# EAGLE design snesbreakout (EAGLE 4.15)
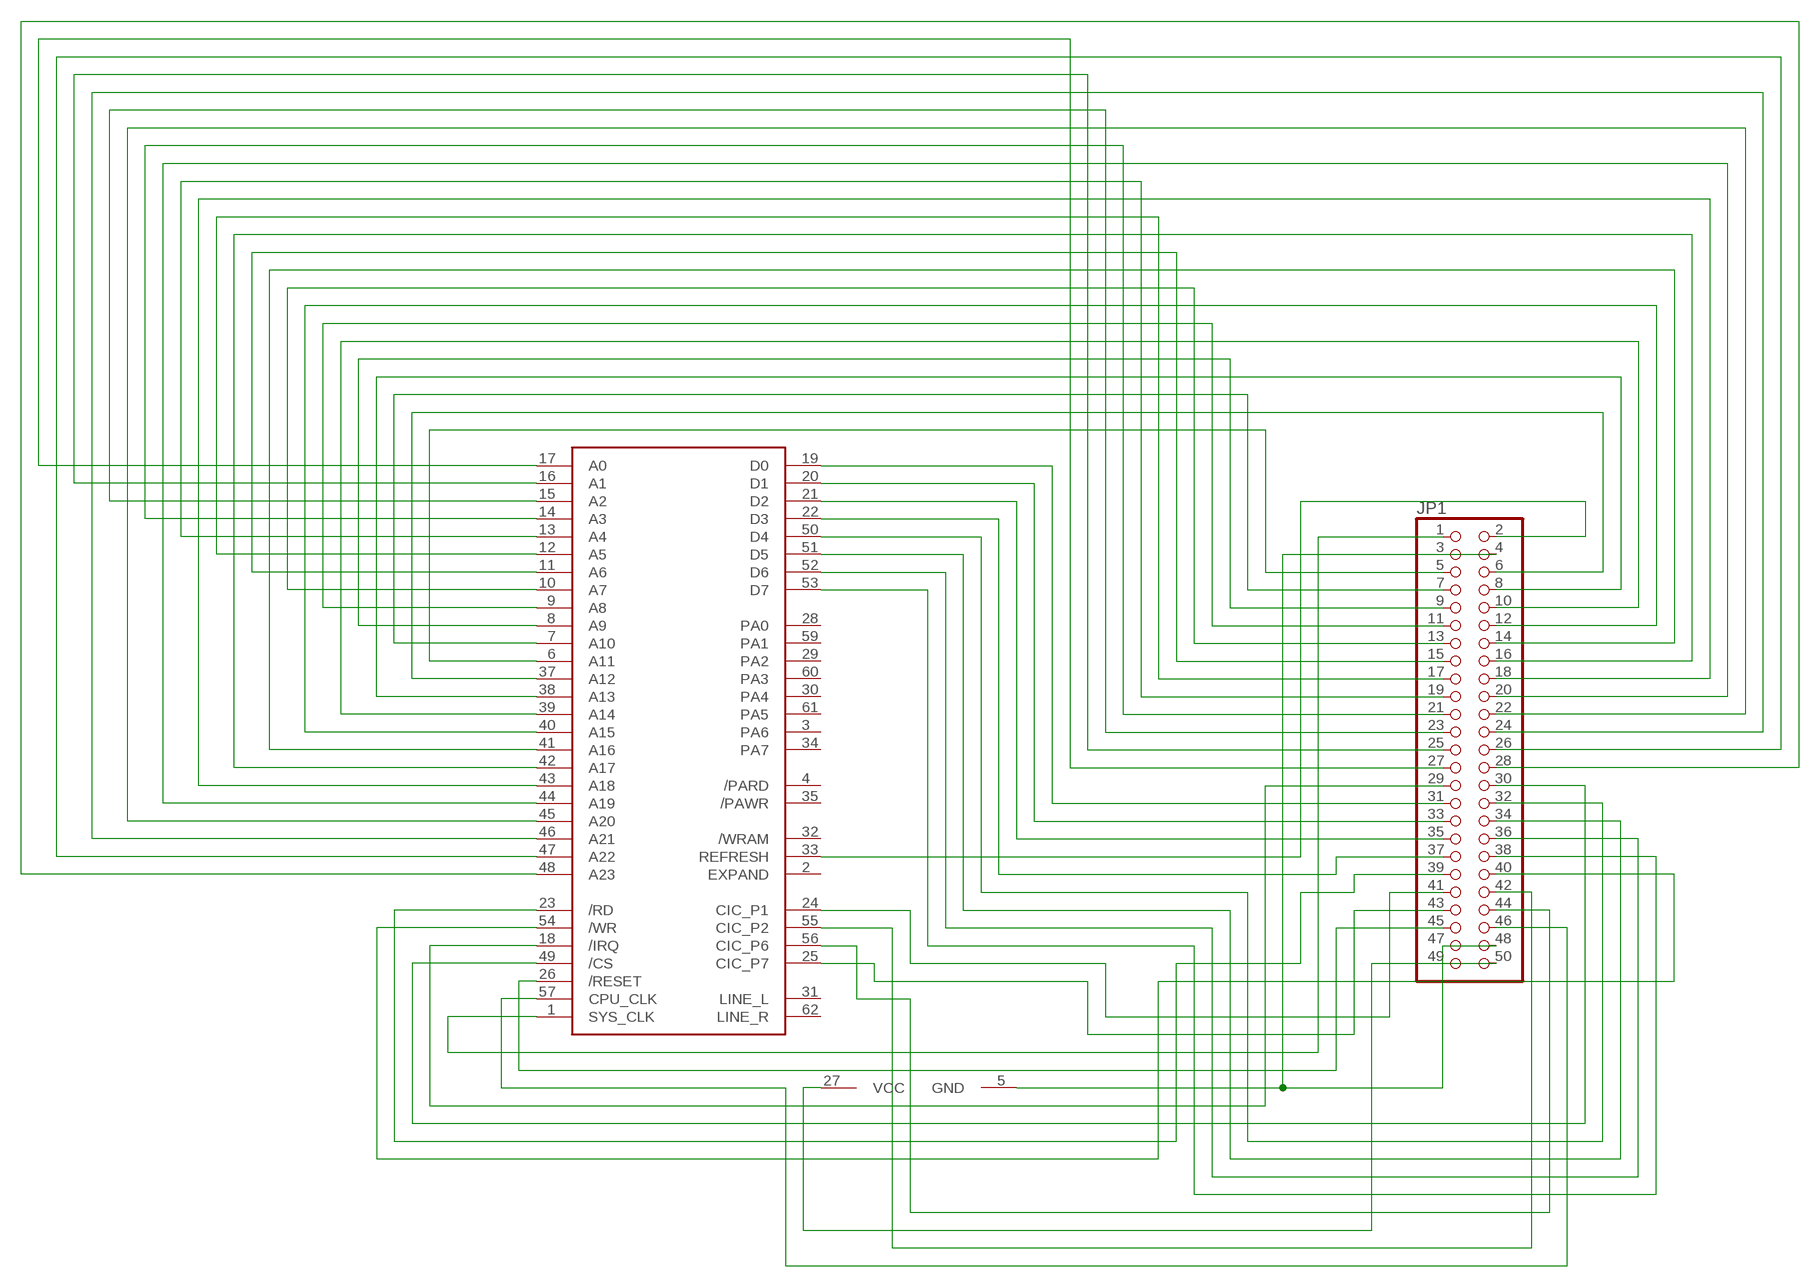
[diagram p0: schematic, sheet 1]

## Parts
JP1  PINHD-2X25  [2X25]
U$1  SNESCART  [SNESCART]

## Nets
GND: JP1.3 JP1.4 JP1.47 JP1.48 U$1.5(GND)
N$1: JP1.1 U$1.1(SYS_CLK)
N$2: JP1.2 U$1.33(REFRESH)
N$4: JP1.5 U$1.6(A11)
N$5: JP1.6 U$1.37(A12)
N$6: JP1.7 U$1.7(A10)
N$7: JP1.8 U$1.38(A13)
N$8: JP1.9 U$1.8(A9)
N$9: JP1.10 U$1.39(A14)
N$10: JP1.11 U$1.9(A8)
N$11: JP1.12 U$1.40(A15)
N$12: JP1.13 U$1.10(A7)
N$13: JP1.14 U$1.41(A16)
N$14: JP1.15 U$1.11(A6)
N$15: JP1.16 U$1.42(A17)
N$16: JP1.17 U$1.12(A5)
N$17: JP1.18 U$1.43(A18)
N$18: JP1.19 U$1.13(A4)
N$19: JP1.20 U$1.44(A19)
N$20: JP1.21 U$1.14(A3)
N$21: JP1.22 U$1.45(A20)
N$22: JP1.23 U$1.15(A2)
N$23: JP1.24 U$1.46(A21)
N$24: JP1.25 U$1.16(A1)
N$25: JP1.26 U$1.47(A22)
N$26: JP1.27 U$1.17(A0)
N$27: JP1.28 U$1.48(A23)
N$28: JP1.29 U$1.18(/IRQ)
N$29: JP1.30 U$1.49(/CS)
N$30: JP1.31 U$1.19(D0)
N$31: JP1.33 U$1.20(D1)
N$32: JP1.35 U$1.21(D2)
N$33: JP1.37 U$1.22(D3)
N$34: JP1.32 U$1.50(D4)
N$35: JP1.34 U$1.51(D5)
N$36: JP1.36 U$1.52(D6)
N$37: JP1.38 U$1.53(D7)
N$38: JP1.39 U$1.23(/RD)
N$39: JP1.40 U$1.54(/WR)
N$40: JP1.45 U$1.26(/RESET)
N$41: JP1.46 U$1.57(CPU_CLK)
N$42: JP1.49 JP1.50 U$1.27(VCC)
N$43: JP1.41 U$1.24(CIC_P1)
N$44: JP1.42 U$1.55(CIC_P2)
N$45: JP1.43 U$1.25(CIC_P7)
N$46: JP1.44 U$1.56(CIC_P6)
Unconnected: U$1.2(EXPAND) U$1.3(PA6) U$1.4(/PARD) U$1.28(PA0) U$1.29(PA2) U$1.30(PA4) U$1.31(LINE_L) U$1.32(/WRAM) U$1.34(PA7) U$1.35(/PAWR) U$1.59(PA1) U$1.60(PA3) U$1.61(PA5) U$1.62(LINE_R)

## Power pins joined to a net without a drawn wire
GND: U$1.36(GND$1)
VCC$1: U$1.58(VCC$1)

## Library data of the parts
JP1 = pinhead:PINHD-2X25: PIN HEADER
U$1 = snescart:SNESCART

## Board
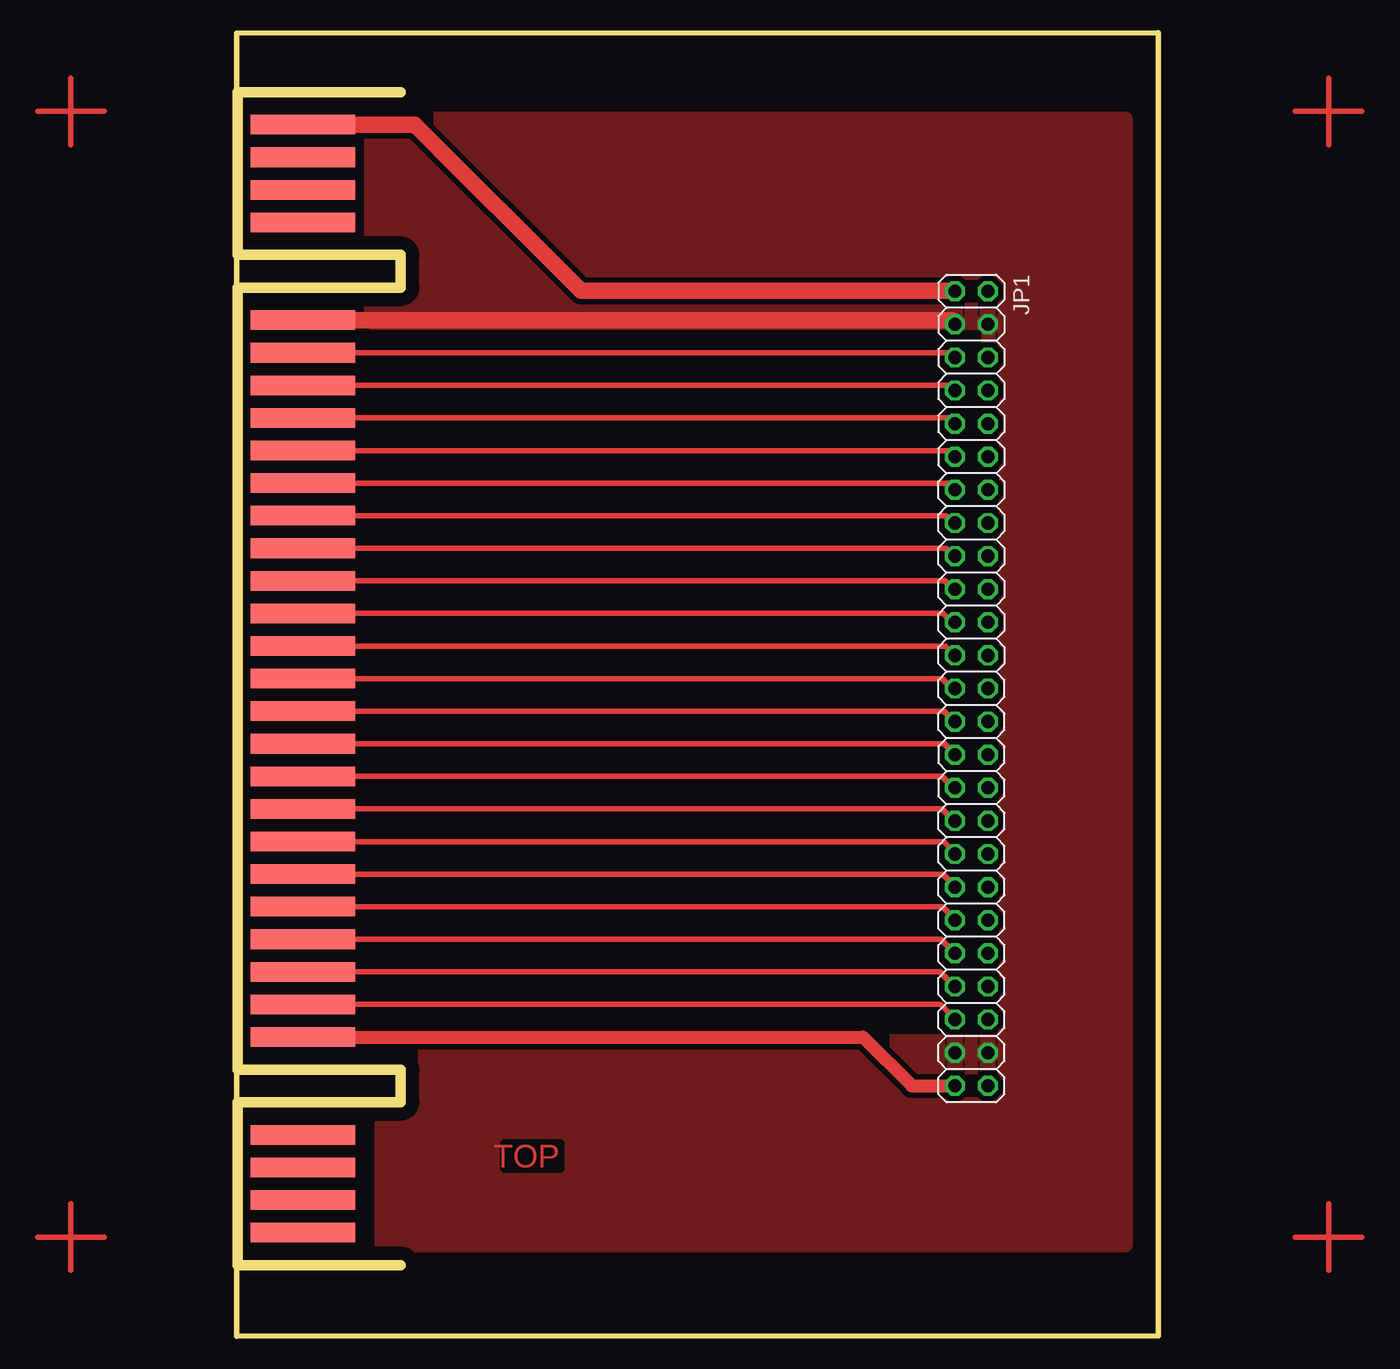
[diagram p1: board, top side]
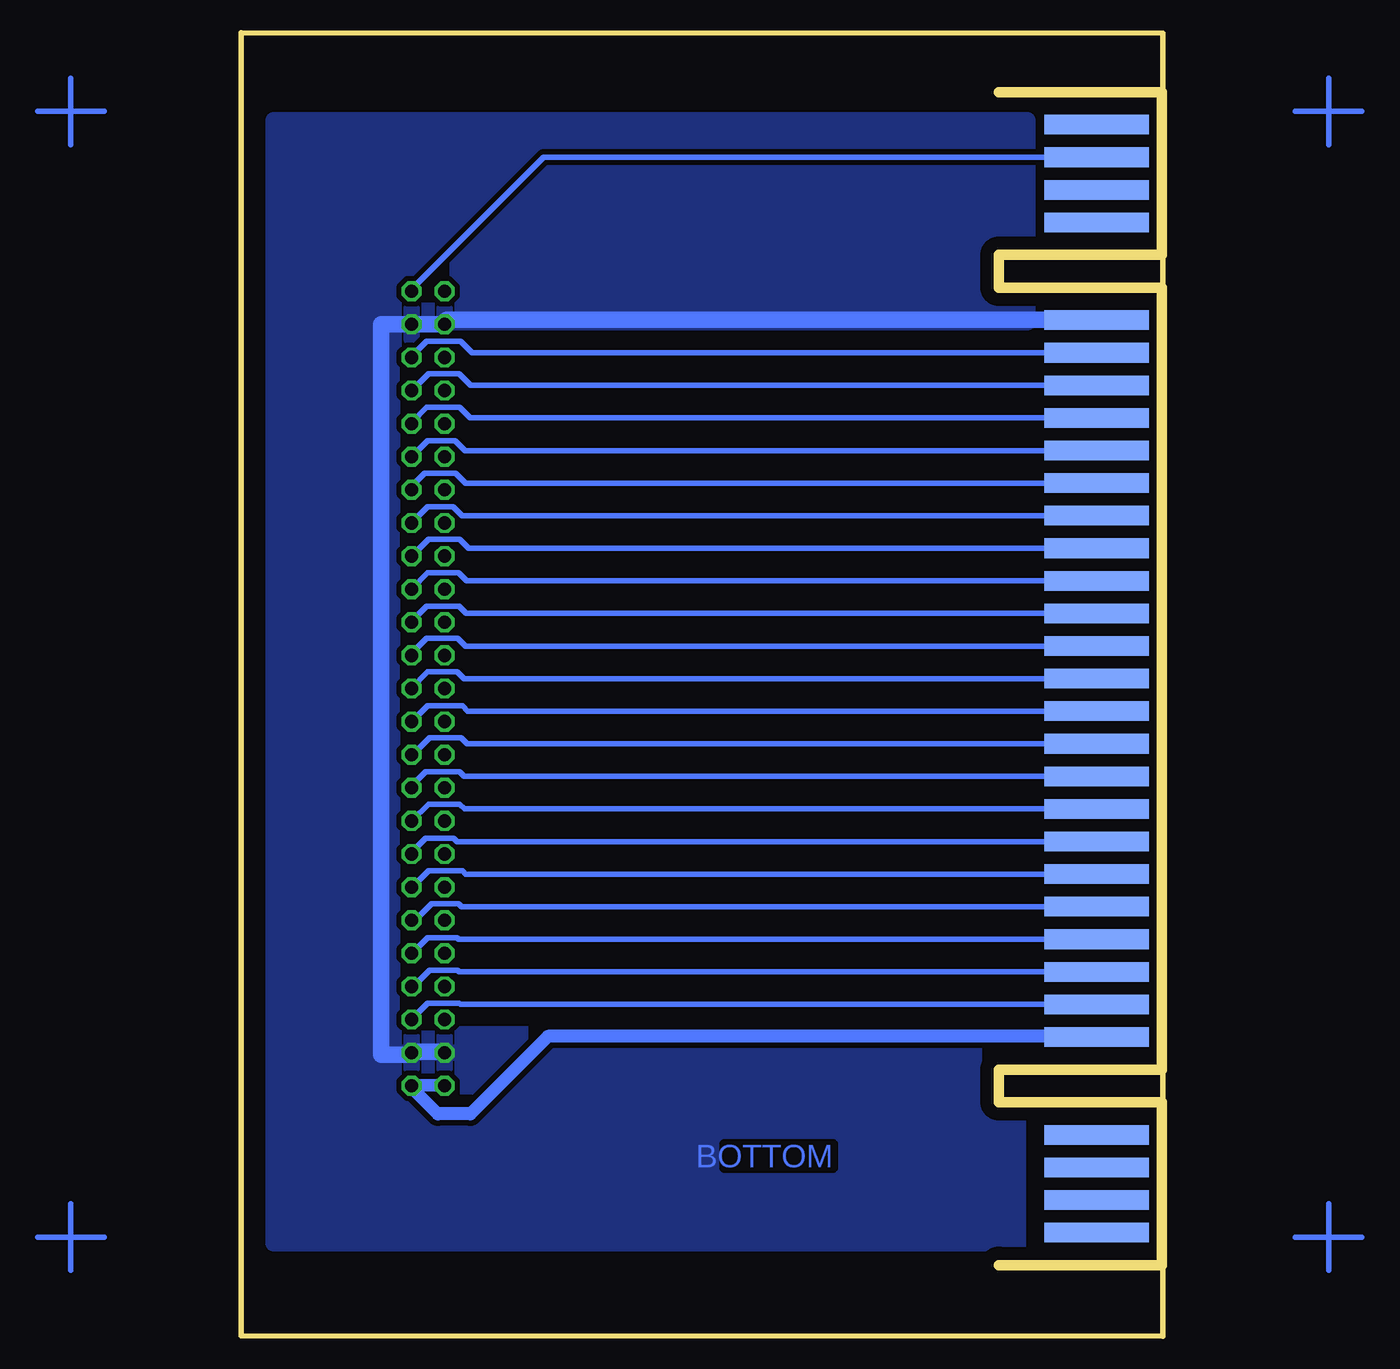
[diagram p2: board, bottom side, seen from below]

Size 70.75 x 100.03 mm. Coordinates in mm from the lower left corner, seen from the top.
Outline: 0,0 70.75,0.03 70.75,100.03 0,100 0,0
Copper layers (1*16): Top 0.035mm / dielectric 1.5mm / Bottom 0.035mm
Design rules "default": minimum track width 10mil, minimum drill 24mil, track to track 8mil, track to pad 8mil, pad to pad 8mil, via to via 8mil, smd to smd 8mil, copper to edge 40mil, drill to drill 8mil, minimum pad ring 10mil, minimum via ring 8mil, stop-mask expansion 4mil, vias tented up to drill 0mil, thermal gap 10mil

### Footprints (pad centres in the part's own frame; a part is rotated, then mirrored left to right if it is on the bottom)
2X25 = drill 1.016 octagon: 1 -30.48,-1.27; 2 -30.48,1.27; 3 -27.94,-1.27; 4 -27.94,1.27; 5 -25.4,-1.27; 6 -25.4,1.27; 7 -22.86,-1.27; 8 -22.86,1.27; 9 -20.32,-1.27; 10 -20.32,1.27; 11 -17.78,-1.27; 12 -17.78,1.27; 13 -15.24,-1.27; 14 -15.24,1.27; 15 -12.7,-1.27; 16 -12.7,1.27; 17 -10.16,-1.27; 18 -10.16,1.27; 19 -7.62,-1.27; 20 -7.62,1.27; 21 -5.08,-1.27; 22 -5.08,1.27; 23 -2.54,-1.27; 24 -2.54,1.27; 25 0,-1.27; 26 0,1.27; 27 2.54,-1.27; 28 2.54,1.27; 29 5.08,-1.27; 30 5.08,1.27; 31 7.62,-1.27; 32 7.62,1.27; 33 10.16,-1.27; 34 10.16,1.27; 35 12.7,-1.27; 36 12.7,1.27; 37 15.24,-1.27; 38 15.24,1.27; 39 17.78,-1.27; 40 17.78,1.27; 41 20.32,-1.27; 42 20.32,1.27; 43 22.86,-1.27; 44 22.86,1.27; 45 25.4,-1.27; 46 25.4,1.27; 47 27.94,-1.27; 48 27.94,1.27; 49 30.48,-1.27; 50 30.48,1.27
SNESCART = smd 1.5 x 8: 1 -42.5,0; 2 -40,0; 3 -37.5,0; 4 -35,0; 5 -27.5,0; 6 -25,0; 7 -22.5,0; 8 -20,0; 9 -17.5,0; 10 -15,0; 11 -12.5,0; 12 -10,0; 13 -7.5,0; 14 -5,0; 15 -2.5,0; 16 0,0; 17 2.5,0; 18 5,0; 19 7.5,0; 20 10,0; 21 12.5,0; 22 15,0; 23 17.5,0; 24 20,0; 25 22.5,0; 26 25,0; 27 27.5,0; 28 35,0; 29 37.5,0; 30 40,0; 31 42.5,0 | smd 1.5 x 8 bottom: 32 -42.5,0; 33 -40,0; 34 -37.5,0; 35 -35,0; 36 -27.5,0; 37 -25,0; 38 -22.5,0; 39 -20,0; 40 -17.5,0; 41 -15,0; 42 -12.5,0; 43 -10,0; 44 -7.5,0; 45 -5,0; 46 -2.5,0; 47 0,0; 48 2.5,0; 49 5,0; 50 7.5,0; 51 10,0; 52 12.5,0; 53 15,0; 54 17.5,0; 55 20,0; 56 22.5,0; 57 25,0; 58 27.5,0; 59 35,0; 60 37.5,0; 61 40,0; 62 42.5,0

### Placement (x,y rotation side)
JP1  56.41,49.71 270 top
U$1  5.11,50.47 270 top

### Tracks (layer width: path | path; a pad name or v marks a point on that pad's centre or on a via)
GND
  Top 0.406: JP1.3 55.14,77.86 55,78 54.97,77.97
  Top 1.27: 54.97,77.97 U$1.36
  Bottom 0.406: 55.14,77.86 55,78 | 55.14,77.86 JP1.3 | 55.35,77.65 55.14,77.86
  Bottom 1.27: 55.35,77.65 JP1.4 60,77.65 60,21.62 57.64,21.62 57.64,21.77 | JP1.47 55.14,21.85 57.68,21.85 JP1.48 57.64,21.77 | 57.64,21.77 | 55,78 5.23,78 | 5.23,78 5.2,77.97 U$1.36 | 5.23,78 5,78 | 5.23,78 5.24,78.01
  pour Bottom (isolate 0.406): 11.07,7.16 68.25,7.16 68.25,93.29 10.41,93.29 10.41,77.79 57.64,77.79 57.64,23.18 11.14,23.18 11.14,7.23
  pour Top (isolate 0.406): 10.4,93.37 68.17,93.37 68.17,7.09 11.22,7.09 11.22,22.58 57.79,22.58 57.79,77.87 10.41,77.87 10.41,90.94
N$1
  Top 0.406: 55,80 55,80.19 JP1.1
  Top 0.813: 55,80 55.14,80.14 JP1.1
  Top 1.27: U$1.1 13.69,92.97 26.45,80.21 55.11,80.21 55.14,80.24 | 55.14,80.24 55.21,80.31 | 55.14,80.24 JP1.1
N$2
  Bottom 0.406: U$1.33 47.53,90.47 57.81,80.19
  Bottom 0.813: 58,80 57.81,80.19 JP1.2
N$3
  Bottom 0.406: -12.7,93.98 -15.24,93.98 | -12.7,93.98 -10.16,93.98 | -12.7,93.98 -12.7,96.52 | -12.7,91.44 -12.7,93.98
N$4
  Top 0.406: JP1.5 55.1,75.11 55.07,75.08 54.68,75.47 U$1.6
N$5
  Bottom 0.406: U$1.37 53.02,75.47 53.91,76.36 56.53,76.36 57.76,75.12 57.75,75.11 JP1.6
N$6
  Top 0.406: JP1.7 55.14,72.6 55.15,72.61 54.78,72.97 U$1.7
N$7
  Bottom 0.406: U$1.38 53.16,72.97 54.03,73.84 56.38,73.84 57.68,72.55 | 57.68,72.55 57.71,72.52 | 57.68,72.55 JP1.8
N$8
  Top 0.406: JP1.9 55.09,70.03 55.06,70 54.59,70.47 U$1.8
N$9
  Bottom 0.406: U$1.39 53.18,70.47 53.99,71.28 56.51,71.28 57.68,70.11 JP1.10
N$10
  Top 0.406: 55.17,67.49 55.21,67.45 | 55.17,67.49 JP1.11 | U$1.9 54.69,67.97 55.17,67.49
N$11
  Bottom 0.406: U$1.40 53.58,67.97 54.34,68.73 56.44,68.73 JP1.12
N$12
  Top 0.406: JP1.13 55.14,64.97 55.16,64.99 54.67,65.47 U$1.10
N$13
  Bottom 0.406: U$1.41 53.54,65.47 54.29,66.22 56.7,66.22 57.88,65.04 57.79,64.95 JP1.14
N$14
  Top 0.406: JP1.15 55.14,62.35 55.11,62.32 54.46,62.97 U$1.11
N$15
  Bottom 0.406: U$1.42 53.81,62.97 54.49,63.65 56.44,63.65 JP1.16
N$16
  Top 0.406: JP1.17 55.14,59.84 55.11,59.81 54.45,60.47 U$1.12
N$17
  Bottom 0.406: U$1.43 53.31,60.47 53.98,61.14 56.39,61.14 JP1.18
N$18
  Top 0.406: 55.14,57.22 55.16,57.2 | 55.14,57.22 JP1.19 | U$1.13 54.38,57.97 55.14,57.22
N$19
  Bottom 0.406: U$1.44 53.47,57.97 54.08,58.58 56.44,58.58 57.68,57.34 JP1.20
N$20
  Top 0.406: JP1.21 55.11,54.79 55.01,54.69 54.22,55.47 U$1.14
N$21
  Bottom 0.406: U$1.45 53.48,55.47 54.03,56.02 56.54,56.02 57.77,54.79 | 57.77,54.79 | 57.77,54.79 JP1.22
N$22
  Top 0.406: JP1.23 54.41,52.97 U$1.15
N$23
  Bottom 0.406: U$1.46 53.55,52.97 54.13,53.56 56.54,53.56 57.72,52.38 57.68,52.34 JP1.24
N$24
  Top 0.406: JP1.25 55.05,49.71 55.01,49.66 54.2,50.47 U$1.16
N$25
  Bottom 0.406: U$1.47 53.66,50.47 54.19,50.99 56.44,50.99 57.73,49.71 | 57.73,49.71 57.77,49.66 | 57.73,49.71 JP1.26
N$26
  Top 0.406: 55.14,47.12 55.16,47.1 | 55.14,47.12 JP1.27 | U$1.17 54.29,47.97 55.14,47.12
N$27
  Bottom 0.406: U$1.48 53.36,47.97 53.77,48.38 56.44,48.38 57.67,47.15 JP1.28
N$28
  Top 0.406: 55.17,44.63 55.26,44.54 | 55.17,44.63 JP1.29 | U$1.18 54.33,45.47 55.17,44.63
N$29
  Bottom 0.406: U$1.49 53.43,45.47 53.88,45.92 56.29,45.92 57.62,44.59 57.66,44.63 JP1.30
N$30
  Top 0.406: JP1.31 55.04,42.09 54.16,42.97 U$1.19
N$31
  Top 0.406: JP1.33 55.07,39.55 54.15,40.47 U$1.20
N$32
  Top 0.406: JP1.35 55.17,37.01 55.21,37.05 54.3,37.97 U$1.21
N$33
  Top 0.406: JP1.37 55.14,34.52 55.16,34.54 54.23,35.47 U$1.22
N$34
  Bottom 0.406: U$1.50 53.64,42.97 53.98,43.31 56.59,43.31 57.81,42.09 | 57.81,42.09 57.83,42.08 | 57.81,42.09 JP1.32
N$35
  Bottom 0.406: U$1.51 53.6,40.47 53.98,40.85 56.39,40.85 JP1.34
N$36
  Bottom 0.406: U$1.52 54.18,37.97 54.44,38.23 56.59,38.23 57.82,37.01 | 57.82,37.01 57.83,37 | 57.82,37.01 JP1.36
N$37
  Bottom 0.406: U$1.53 53.52,35.47 53.77,35.72 56.39,35.72 57.68,34.43 | 57.68,34.43 57.72,34.39 | 57.68,34.43 JP1.38
N$38
  Top 0.406: 55.21,31.93 | 55.21,31.93 JP1.39 | U$1.23 54.17,32.97 55.21,31.93
N$39
  Bottom 0.406: U$1.54 53.84,32.97 54.08,33.21 56.13,33.21 57.57,31.78 57.68,31.89 JP1.40
N$40
  Top 0.406: 55.19,24.31 55.31,24.19 | 55.19,24.31 JP1.45 | U$1.26 54.03,25.47 55.19,24.31
N$41
  Bottom 0.406: U$1.57 53.93,25.47 54.03,25.57 56.44,25.57 57.7,24.31 | 57.7,24.31 57.72,24.29 | 57.7,24.31 JP1.46
N$42
  Top 1.016: U$1.27 48.08,22.97 51.83,19.22 55.11,19.22 55.14,19.19 | 55.14,19.19 55.16,19.17 | 55.14,19.19 JP1.49
  Bottom 1.016: JP1.49 55.11,19.27 JP1.50
N$43
  Top 0.406: JP1.41 54.06,30.47 U$1.24
N$44
  Bottom 0.406: U$1.55 54.06,30.47 54.19,30.6 56.44,30.6 57.68,29.36 | 57.68,29.36 57.72,29.32 | 57.68,29.36 JP1.42
N$45
  Top 0.406: 55.14,26.82 55.16,26.8 | 55.14,26.82 JP1.43 | U$1.25 53.99,27.97 55.14,26.82
N$46
  Bottom 0.406: U$1.56 54.02,27.97 54.13,28.09 56.29,28.09 57.62,26.75 57.68,26.81 JP1.44
N$47
  Top 0.406: -12.7,93.98 -10.16,93.98 | -12.7,93.98 -15.24,93.98 | -12.7,93.98 -12.7,96.52 | -12.7,91.44 -12.7,93.98
N$48
  Bottom 1.016: 5.23,23.01 47.22,23.01 53.16,17.07 55.67,17.07 57.72,19.12
N$49
  Bottom 0.406: 83.82,93.98 81.28,93.98 | 83.82,93.98 86.36,93.98 | 83.82,93.98 83.82,96.52 | 83.82,91.44 83.82,93.98
N$50
  Top 0.406: 83.82,93.98 86.36,93.98 | 83.82,93.98 81.28,93.98 | 83.82,93.98 83.82,96.52 | 83.82,91.44 83.82,93.98
N$51
  Bottom 0.406: 83.82,7.62 81.28,7.62 | 83.82,7.62 86.36,7.62 | 83.82,7.62 83.82,10.16 | 83.82,5.08 83.82,7.62
N$52
  Top 0.406: 83.82,7.62 86.36,7.62 | 83.82,7.62 81.28,7.62 | 83.82,7.62 83.82,10.16 | 83.82,5.08 83.82,7.62
N$53
  Bottom 0.406: -12.7,7.62 -15.24,7.62 | -12.7,7.62 -10.16,7.62 | -12.7,10.16 -12.7,7.62 | -12.7,7.62 -12.7,5.08
N$54
  Top 0.406: -12.7,7.62 -10.16,7.62 | -12.7,7.62 -15.24,7.62 | -12.7,10.16 -12.7,7.62 | -12.7,7.62 -12.7,5.08

### Text on the board
Top: TOP
Bottom: BOTTOM